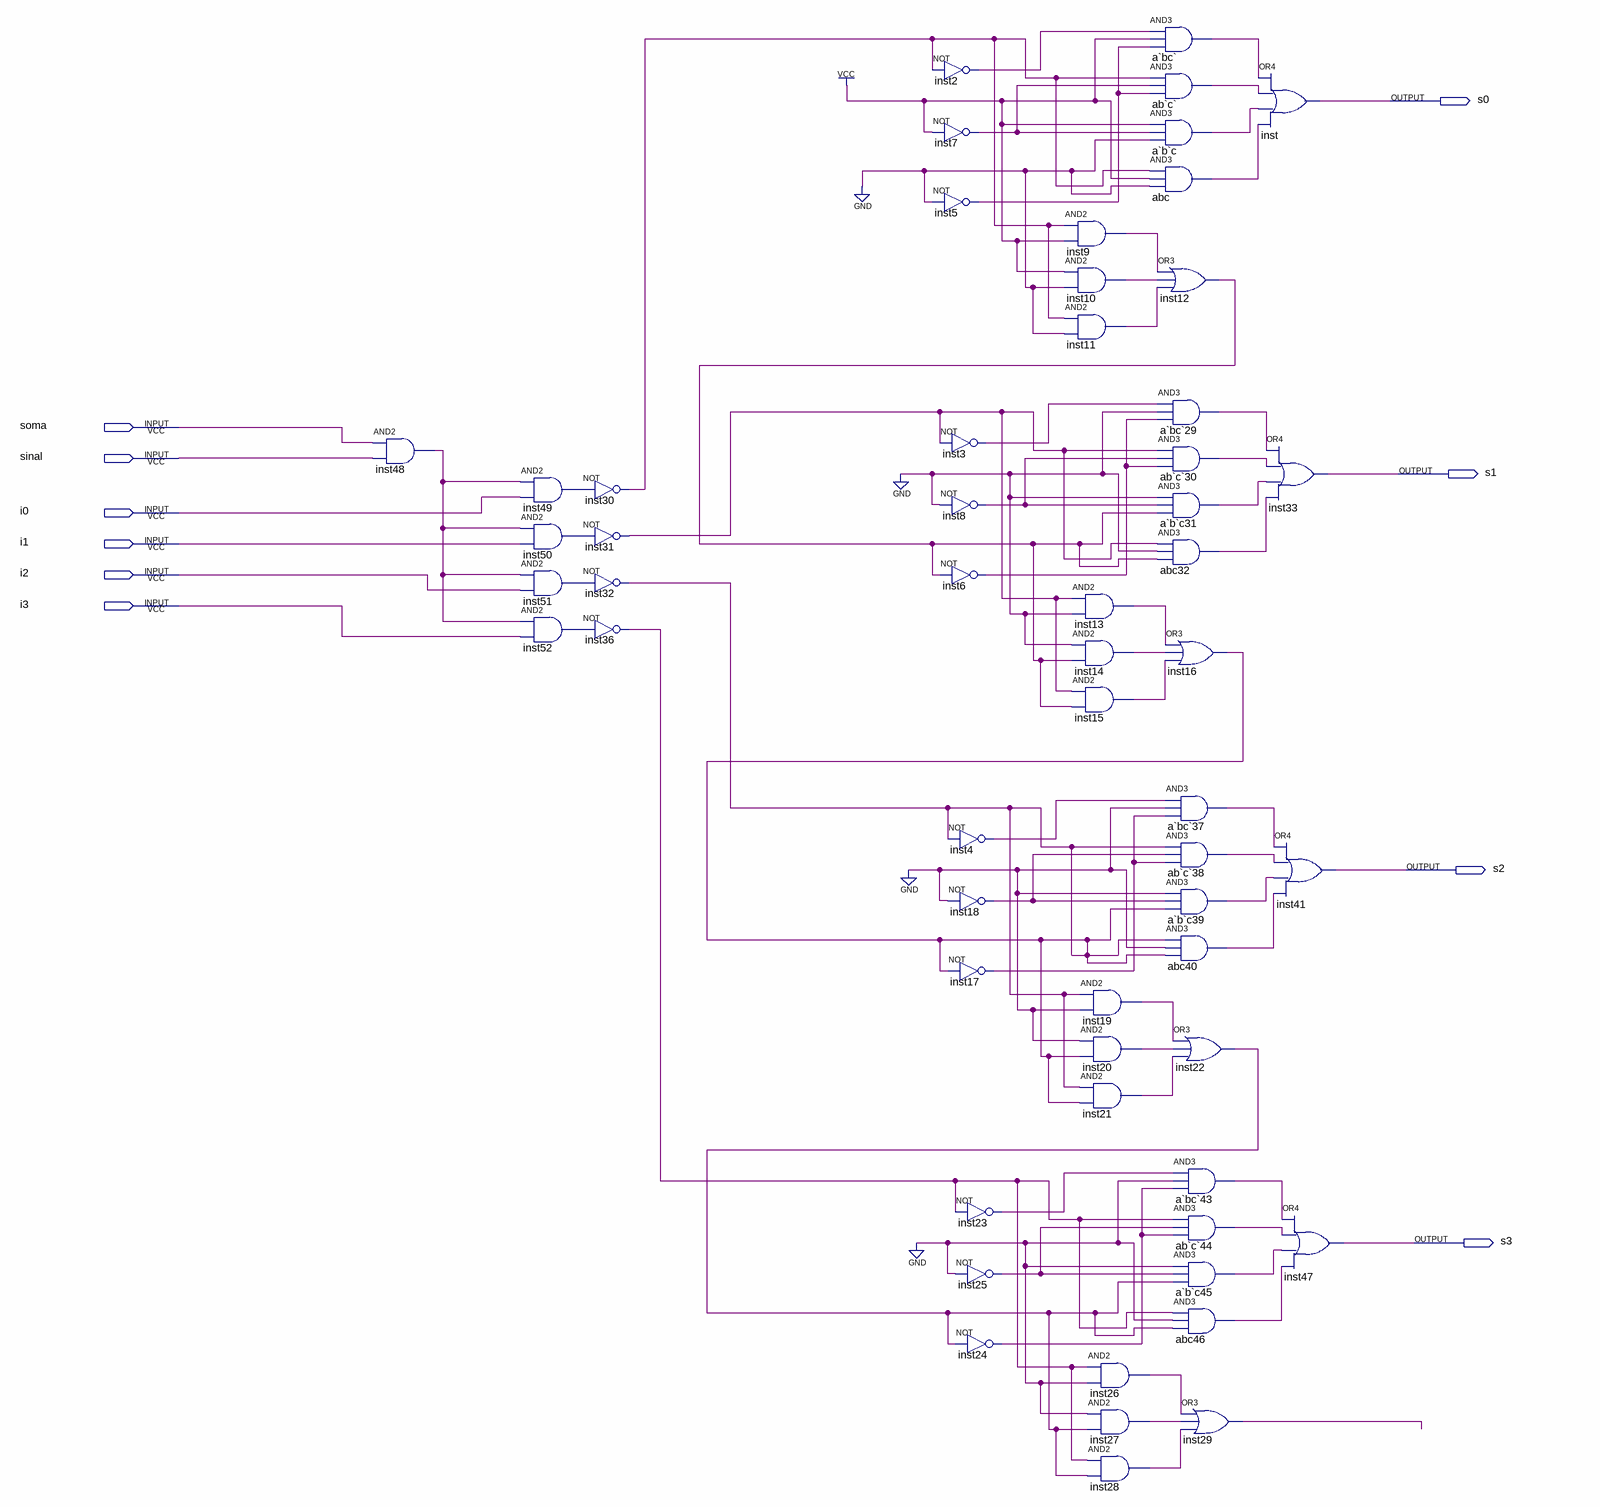
[diagram p0: schematic sheet]
// Quartus schematic ULAULA-SOMA-complemento2.bdf as structural Verilog: 57 symbols, 10 pins
module \ULAULA-SOMA-complemento2  (
  input  soma,
  input  sinal,
  input  i0,
  input  i1,
  input  i2,
  input  i3,
  output s0,
  output s1,
  output s2,
  output s3
);

  wire a_b_c31_out, a_b_c39_out, a_b_c45_out, a_b_c_out, a_bc_29_out, a_bc_37_out, a_bc_43_out, a_bc__out,
       ab_c_30_out, ab_c_38_out, ab_c_44_out, ab_c__out, abc32_out, abc40_out, abc46_out, abc_out, inst2_out,
       inst3_out, inst4_out, inst5_out, inst6_out, inst7_out, inst8_out, inst9_out, inst10_out, inst11_out,
       inst12_out, inst13_out, inst14_out, inst15_out, inst17_out, inst18_out, inst19_out, inst20_out,
       inst21_out, inst22_out, inst23_out, inst24_out, inst25_out, inst26_out, inst27_out, inst28_out,
       inst29_out, inst30_out, inst31_out, inst32_out, inst36_out, inst48_out, inst49_out, inst50_out,
       inst51_out, inst52_out;

  and inst48 (inst48_out, soma, sinal);
  and inst49 (inst49_out, inst48_out, i0);
  and inst50 (inst50_out, inst48_out, i1);
  and inst51 (inst51_out, inst48_out, i2);
  and inst52 (inst52_out, inst48_out, i3);
  not inst30 (inst30_out, inst49_out);
  not inst31 (inst31_out, inst50_out);
  not inst32 (inst32_out, inst51_out);
  not inst36 (inst36_out, inst52_out);
  not inst2 (inst2_out, inst30_out);
  not inst7 (inst7_out, 1'b1);
  not inst5 (inst5_out, 1'b0);
  not inst3 (inst3_out, inst31_out);
  not inst8 (inst8_out, 1'b0);
  not inst6 (inst6_out, inst12_out);
  not inst4 (inst4_out, inst32_out);
  not inst18 (inst18_out, 1'b0);
  not inst17 (inst17_out, inst32_out);
  not inst23 (inst23_out, inst36_out);
  not inst25 (inst25_out, 1'b0);
  not inst24 (inst24_out, inst22_out);
  and inst9 (inst9_out, inst30_out, 1'b1);
  and inst10 (inst10_out, 1'b1, 1'b0);
  and inst11 (inst11_out, inst30_out, 1'b0);
  and inst13 (inst13_out, inst31_out, 1'b0);
  and inst14 (inst14_out, 1'b0, inst12_out);
  and inst15 (inst15_out, inst31_out, inst12_out);
  and inst19 (inst19_out, inst32_out, 1'b0);
  and inst20 (inst20_out, 1'b0, inst32_out);
  and inst21 (inst21_out, inst32_out, inst32_out);
  and inst26 (inst26_out, inst36_out, 1'b0);
  and inst27 (inst27_out, 1'b0, inst22_out);
  and inst28 (inst28_out, inst36_out, inst22_out);
  and \a`bc`  (a_bc__out, inst2_out, 1'b1, inst5_out);
  and \ab`c`  (ab_c__out, inst30_out, inst7_out, inst5_out);
  and \a`b`c  (a_b_c_out, 1'b1, inst7_out, 1'b0);
  and abc (abc_out, inst30_out, 1'b1, 1'b0);
  or inst12 (inst12_out, inst9_out, inst10_out, inst11_out);
  and \a`bc`29  (a_bc_29_out, inst3_out, 1'b0, inst6_out);
  and \ab`c`30  (ab_c_30_out, inst31_out, inst8_out, inst6_out);
  and \a`b`c31  (a_b_c31_out, 1'b0, inst8_out, inst12_out);
  and abc32 (abc32_out, inst31_out, 1'b0, inst12_out);
  or inst16 (inst32_out, inst13_out, inst14_out, inst15_out);
  and \a`bc`37  (a_bc_37_out, inst4_out, 1'b0, inst17_out);
  and \ab`c`38  (ab_c_38_out, inst32_out, inst18_out, inst17_out);
  and \a`b`c39  (a_b_c39_out, 1'b0, inst18_out, inst32_out);
  and abc40 (abc40_out, inst32_out, 1'b0, inst32_out);
  or inst22 (inst22_out, inst19_out, inst20_out, inst21_out);
  and \a`bc`43  (a_bc_43_out, inst23_out, 1'b0, inst24_out);
  and \ab`c`44  (ab_c_44_out, inst36_out, inst25_out, inst24_out);
  and \a`b`c45  (a_b_c45_out, 1'b0, inst25_out, inst22_out);
  and abc46 (abc46_out, inst36_out, 1'b0, inst22_out);
  or inst29 (inst29_out, inst26_out, inst27_out, inst28_out);
  or inst (s0, a_bc__out, ab_c__out, a_b_c_out, abc_out);
  or inst33 (s1, a_bc_29_out, ab_c_30_out, a_b_c31_out, abc32_out);
  or inst41 (s2, a_bc_37_out, ab_c_38_out, a_b_c39_out, abc40_out);
  or inst47 (s3, a_bc_43_out, ab_c_44_out, a_b_c45_out, abc46_out);
endmodule
